# EAGLE design untitled (EAGLE 6.1)
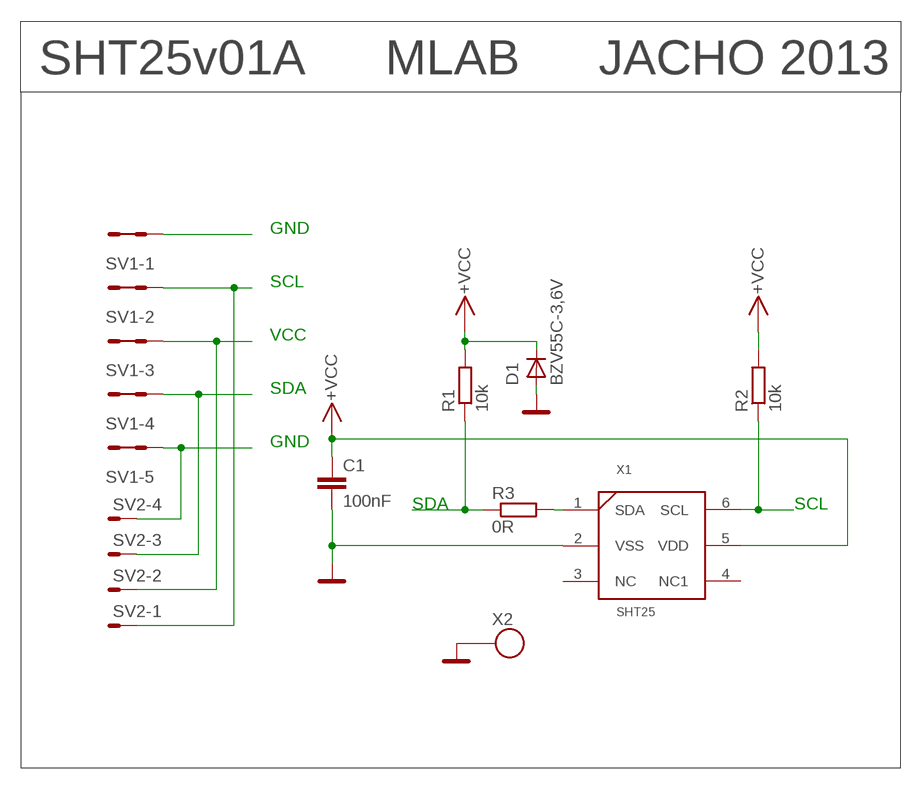
[diagram p0: schematic, sheet 1]

## Parts
C1  100nF  C-EUC0805  [C0805]
D1  BZV55C-3,6V  D-OB.SMA  [SMA]
R1  10k  R-EU_R0805  [R0805]
R2  10k  R-EU_R0805  [R0805]
R3  0R  R-EU_R0805  [R0805]
SV1  MA05-2  [MA05-2]
SV2  SMD_MA04-01  [SMD_MA04-1]
X1  SHT25  [SHT25]
X2  SROUB3M  [SROUB3M]

## Nets
GND: C1.2 D1.A SV1.1 SV1.2 SV1.9 SV1.10 SV2.4 X1.2(VSS) X2.P$1
N$2: R3.2 X1.1(SDA)
SCL: R2.1 SV1.3 SV1.4 SV2.1 X1.6(SCL)
SDA: R1.1 R3.1 SV1.7 SV1.8 SV2.3
VCC: C1.1 D1.K(C) R1.2 R2.2 SV1.5 SV1.6 SV2.2 X1.5(VDD) ; supply symbol labelled +VCC
Unconnected: X1.3(NC) X1.4(NC1)

## Notes on the sheet
- SHT25v01A | MLAB | JACHO 2013
- GND
- SCL
- VCC
- SDA
- GND
- SDA | SCL

## Library data of the parts
C1 = rcl:C-EU: CAPACITOR, European symbol
D1 = moje:D-OB.SMA: SMA
R1-R3 = rcl:R-EU_: RESISTOR, European symbol
SV1 = moje_hrebinky:MA05-2: PIN HEADER; OC_FARNELL: unknown; OC_NEWARK: unknown
SV2 = moje_hrebinky:SMD_MA04-01
X1 = moje_cidla:SHT25
X2 = moje:SROUB3M

## Board
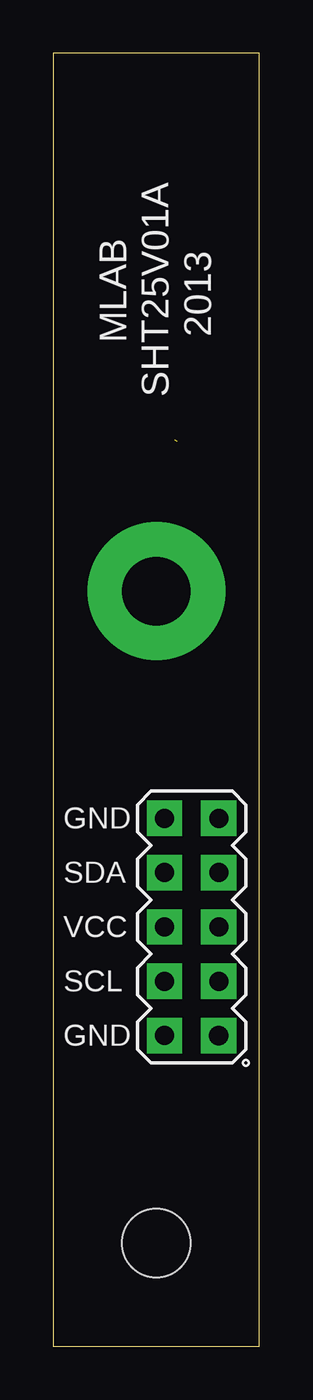
[diagram p1: board, top side]
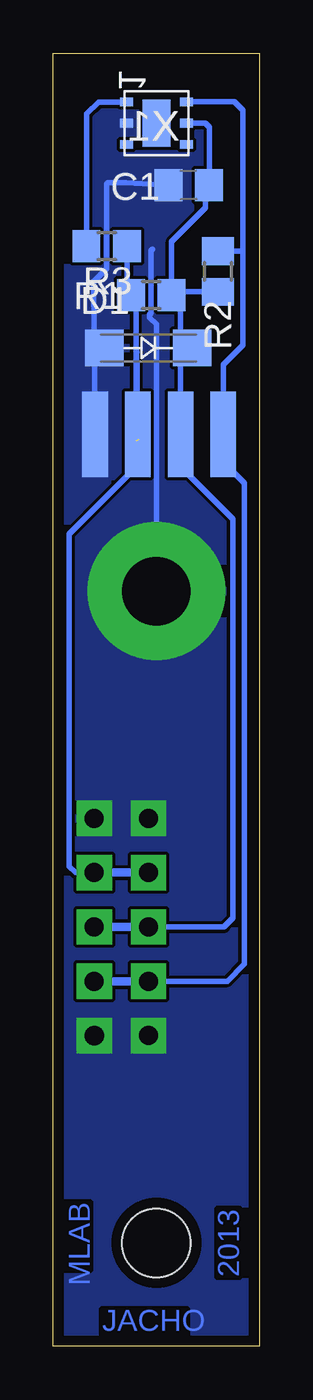
[diagram p2: board, bottom side, seen from below]

Size 9.65 x 60.45 mm. Coordinates in mm from the lower left corner, seen from the top.
Outline: 0,0 9.65,0 9.65,60.45 0,60.45 0,0
Copper layers (1*16): Top 0.035mm / dielectric 1.5mm / Bottom 0.035mm
Design rules: minimum track width 8mil, minimum drill 16mil, track to track 6mil, track to pad 6mil, pad to pad 6mil, via to via 6mil, smd to smd 6mil, copper to edge 20mil, drill to drill 8mil, minimum pad ring 10mil, minimum via ring 8mil, stop-mask expansion 4mil, vias tented up to drill 25mil, thermal gap 0mil
Holes 3.2 mm at 4.83,4.83

### Footprints (pad centres in the part's own frame; a part is rotated, then mirrored left to right if it is on the bottom)
C0805 = smd 1.3 x 1.5: 1 -0.95,0; 2 0.95,0
SMA = smd 1.8 x 1.7: A -2.05,0; K 2.05,0
R0805 = smd 1.3 x 1.5: 1 -0.95,0; 2 0.95,0
MA05-2 = drill 0.914 pad 1.651 square: 1 -5.08,-1.27 | drill 0.889 pad 1.651 square: 2 -5.08,1.27; 3 -2.54,-1.27; 4 -2.54,1.27; 5 0,-1.27; 6 0,1.27; 7 2.54,-1.27; 8 2.54,1.27; 9 5.08,-1.27; 10 5.08,1.27
SMD_MA04-1 = smd 4 x 1.2: 1 0,3; 2 0,1; 3 0,-1; 4 0,-3
SHT25 = smd 0.4 x 0.6: 1 1,1.4; 2 0,1.4; 3 -1,1.4; 4 -1,-1.4; 5 0,-1.4; 6 1,-1.4 | smd 2.2 x 1.3: 7 0,0
SROUB3M = drill 3.2 pad 6.452: P$1 0,0

### Placement (x,y rotation side)
C1  3.32,54.29 180 bottom
D1  [SMA]  5.21,46.68 0 bottom
R1  5.07,49.15 0 bottom
R2  1.95,50.25 270 bottom
R3  7.15,51.44 180 bottom
SV1  6.47,19.6 90 top
SV2  4.7,42.65 270 bottom
X1  4.83,57.19 90 bottom
X2  4.83,35.31 0 top

### Tracks (layer width: path | path; a pad name or v marks a point on that pad's centre or on a via)
GND
  Bottom 0.254: SV2.4 7.76,49.78 7.16,50.38 7.16,54.35 7.09,54.41 6.28,54.41 C1.2 | X2.P$1 4.83,47.79 5.14,48.11 5.14,48.24 5.08,48.3 5.08,51.23 5.01,51.29
  pour Bottom: -0.32,61.47 9.84,61.47 9.91,-0.25 -0.25,-0.25
N$2
  Bottom 0.254: R3.2 8.1,57.62 7.55,58.18 6.24,58.18 X1.1
SCL
  Bottom 0.254: SV1.4 1.51,17.06 0.71,17.86 0.71,40.36 1.63,41.28 1.63,42.58 SV2.1 1.7,45.9 0.79,46.81 0.79,51.23 | X1.6 1.19,58.19 0.79,57.79 0.79,51.23 | R2.1 0.81,51.2 0.79,51.23
  Bottom 0.406: SV1.3 SV1.4
SDA  (1 unrouted)
  Bottom 0.254: 5.79,42.32 5.79,46.42 | 5.79,46.42 5.73,46.48 | 5.79,46.42 5.79,46.68 | SV2.3 5.76,46.65 5.79,46.68 | 5.79,46.68 5.79,49.08 | 5.79,49.08 5.79,49.34 5.86,49.41 | R3.1 6.2,49.33 R1.1 5.86,49.15 5.79,49.08 | SV1.8 8.62,22.14 8.91,22.43 8.91,37.97 5.66,41.22 5.66,42.39
  Bottom 0.406: SV1.7 SV1.8
VCC
  Bottom 0.254: SV1.6 1.67,19.6 1.24,20.03 1.24,38.68 3.91,41.35 3.91,42.44 SV2.2 3.7,48.63 | R2.2 3.97,49.3 R1.2 | R1.2 4.12,51.66 2.54,53.24 2.54,53.96 2.37,54.13 | 2.37,54.13 2.22,54.28 | X1.5 2.53,57.19 2.35,57.01 2.35,54.35 2.37,54.33 C1.1 2.37,54.13 | 3.7,48.63 3.7,48.72 R1.2 | D1.K 3.71,46.68 3.71,48.64 | 3.71,48.69 3.71,48.64 | 3.71,48.64 3.7,48.63
  Bottom 0.406: SV1.6 SV1.5

### Text on the board
Bottom: 2013 | MLAB | JACHO
tPlace: MLAB | 2013 | SHT25V01A | GND | SDA | VCC | SCL | GND